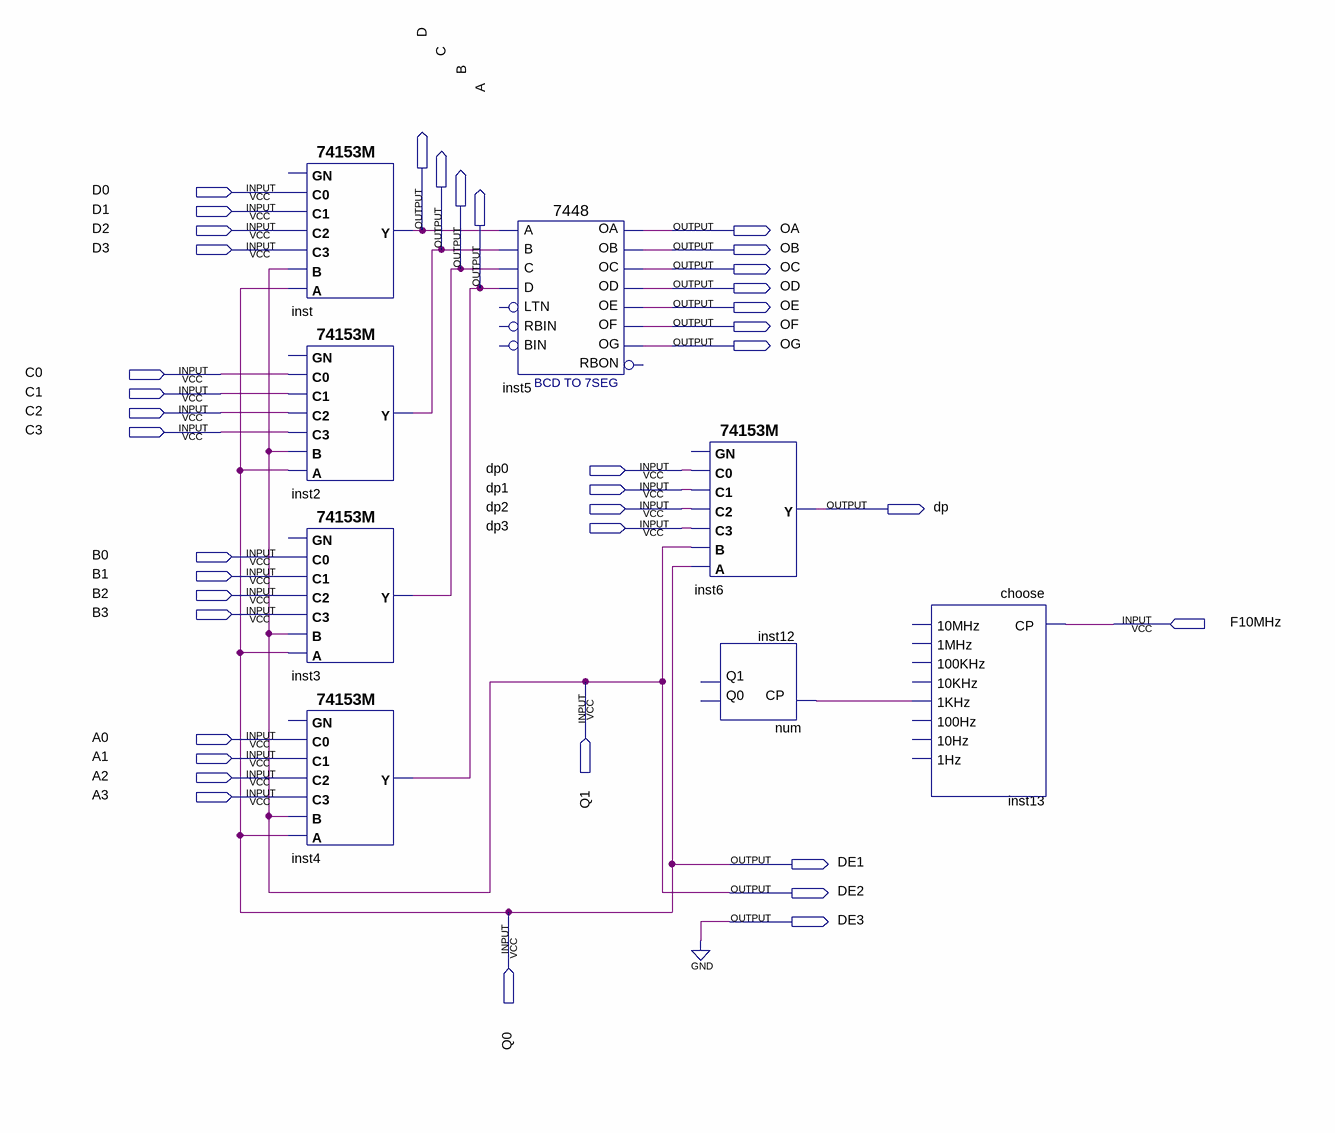
[diagram p0: schematic sheet]
// Quartus schematic view1.bdf as structural Verilog: 8 symbols, 38 pins
module view1 (
  input  D0,
  input  D1,
  input  D2,
  input  D3,
  input  C0,
  input  C1,
  input  C2,
  input  C3,
  input  dp0,
  input  dp1,
  input  dp2,
  input  dp3,
  input  B0,
  input  B1,
  input  B2,
  input  B3,
  input  F10MHz,
  input  Q1,
  input  A0,
  input  A1,
  input  A2,
  input  A3,
  input  Q0,
  output D,
  output OA,
  output C,
  output OB,
  output B,
  output OC,
  output A,
  output OD,
  output OE,
  output OF,
  output OG,
  output dp,
  output DE1,
  output DE2,
  output DE3
);

  wire inst13_1khz;

  \74153M  inst (.A(Q0), .B(Q1), .C3(D3), .C2(D2), .C1(D1), .C0(D0), .Y(D));  // open: GN
  \74153M  inst2 (.A(Q0), .B(Q1), .C3(C3), .C2(C2), .C1(C1), .C0(C0), .Y(C));  // open: GN
  \74153M  inst3 (.A(Q0), .B(Q1), .C3(B3), .C2(B2), .C1(B1), .C0(B0), .Y(B));  // open: GN
  \74153M  inst4 (.A(Q0), .B(Q1), .C3(A3), .C2(A2), .C1(A1), .C0(A0), .Y(A));  // open: GN
  \7448  inst5 (
    .A(D), .C(B), .D(A), .B(C), .OC(OC), .OE(OE), .OD(OD), .OF(OF), .OG(OG), .OB(OB), .OA(OA));  // open: RBIN, BIN, LTN, RBON
  \74153M  inst6 (.A(Q0), .B(Q1), .C3(dp3), .C2(dp2), .C1(dp1), .C0(dp0), .Y(dp));  // open: GN
  num inst12 (.CP(inst13_1khz));  // open: Q0, Q1
  choose inst13 (.CP(F10MHz), .\1KHz (inst13_1khz));  // open: 10MHz, 1MHz, 100KHz, 10KHz, 100Hz, 10Hz, 1Hz

  assign DE1 = Q0;
  assign DE2 = Q1;
  assign DE3 = 1'b0;
endmodule
